# Altium schematic sheet PMW3901.SchDoc
size A4; SheetNumber: 4; SheetTotal: 7
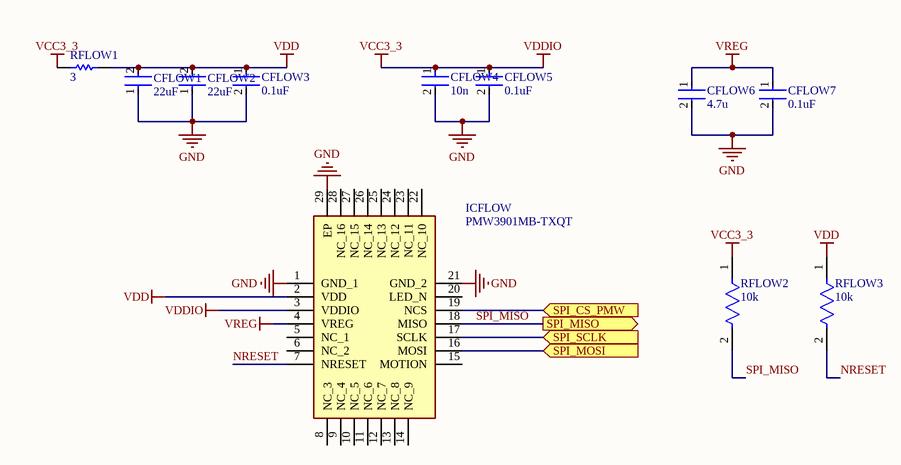
[diagram p0: PMW3901.SchDoc]

## Parts
CFLOW1  22uF  [FP-GRM188-0_2-IPC_C]
CFLOW2  22uF  [FP-GRM188-0_2-IPC_C]
CFLOW3  0.1uF  [FP-CL10-IPC_C]
CFLOW4  10n  [FP-CL10-IPC_A]
CFLOW5  0.1uF  [FP-CL10-IPC_C]
CFLOW6  4.7u  [FP-CL10-IPC_C]
CFLOW7  0.1uF  [FP-CL10-IPC_C]
ICFLOW  PMW3901MB-TXQT  [PMW3901MBTXQT]
RFLOW1  3  [RESC1608X55X30NL15T15]
RFLOW2  10k  [FP-ERJ3G-IPC_C]
RFLOW3  10k  [FP-ERJ3G-IPC_C]

## Ports
SPI_CS_PMW (in), SPI_MISO (out), SPI_MOSI (in), SPI_SCLK (in)

## Nets
GND: CFLOW1.1 CFLOW2.1 CFLOW3.2 CFLOW4.2 CFLOW5.2 CFLOW6.2 CFLOW7.2 ICFLOW.1(GND_1) ICFLOW.21(GND_2) ICFLOW.29(EP)
VCC3_3: CFLOW4.1 CFLOW5.1 ICFLOW.3(VDDIO) RFLOW1.1 RFLOW2.1  [also labelled VDDIO]
VDD: CFLOW1.2 CFLOW2.2 CFLOW3.1 ICFLOW.2(VDD) RFLOW1.2 RFLOW3.1
VREG: CFLOW6.1 CFLOW7.1 ICFLOW.4(VREG)
NRESET: ICFLOW.7(NRESET) RFLOW3.2
SPI_CS_PMW: ICFLOW.19(NCS) ; port SPI_CS_PMW
SPI_MISO: ICFLOW.18(MISO) RFLOW2.2 ; port SPI_MISO
SPI_MOSI: ICFLOW.16(MOSI) ; port SPI_MOSI
SPI_SCLK: ICFLOW.17(SCLK) ; port SPI_SCLK

Not connected (* = marked no-connect by the designer): ICFLOW 5(NC_1) 6(NC_2) 8(NC_3) 9(NC_4) 10(NC_5) 11(NC_6) 12(NC_7) 13(NC_8) 14(NC_9) 15(MOTION) 20(LED_N) 22(NC_10) 23(NC_11) 24(NC_12) 25(NC_13) 26(NC_14) 27(NC_15) 28(NC_16)

## Library data of the parts
CFLOW1 CFLOW2 = CMP-2000-06337-3: Chip Multilayer Ceramic Capacitors for General Purpose, 0603, 22uF, X5R, 15%, 20%, 10V; Tolerance: 20%; Weight: 0.000222oz; Material: Ceramic; Depth: 0.8mm; Length: 1.6mm; Termination: SMD/SMT; Capacitance: 22uF; Packaging: Tape and Reel; Width: 0.8mm; Voltage Rating: 10V; Case Code (Imperial): 0603; Mount: Surface Mount; Voltage Rating (DC): 10V; Case/Package: 0603; Thickness: 0.039inch; REACH SVHC: No SVHC; Dielectric: X5R; Height: 0.8mm; Package Quantity: 4000; Case Code (Metric): 1608; Min Operating Temperature: -55°C; Lead Free: Lead Free; Max Operating Temperature: 85°C
CFLOW3 CFLOW5 CFLOW7 = CMP-13271-001724-1: Cap Ceramic 100nF 50V X7R ±20% Pad SMD 0603 +125°C T/R; Mount: Surface Mount; Lead Free: Lead Free; Max Operating Temperature: 125°C; Voltage Rating: 50V; Case Code (Imperial): 0603; Capacitance: 100nF; Height: 0.8mm; Length: 1.6mm; Tolerance: 20%; Case Code (Metric): 1608; Thickness: 0.035inch; Depth: 0.8mm; Width: 0.031inch; Package Quantity: 1; Min Operating Temperature: -55°C; Case/Package: 0603; Radiation Hardening: No; Voltage Rating (DC): 50V; Dielectric: X7R; Packaging: Tape and Reel
CFLOW4 = CMP-13271-001215-1: Cap Ceramic 10nF 50V X7R ±10% Pad SMD 0603 +125°C T/R; Dielectric: X7R; Features: Soft Termination; Packaging: Tape and Reel; Voltage Rating: 50V; Ratings: AEC-Q200; Radiation Hardening: No; Height: 0.8mm; Package Quantity: 4000; Case Code (Metric): 1608; Capacitance: 10nF; Length: 1.6mm; Width: 0.031inch; Case/Package: 0603; Thickness: 0.035inch; Tolerance: 10%; Max Operating Temperature: 125°C; Lead Free: Lead Free; Mount: Surface Mount; Min Operating Temperature: -55°C; Case Code (Imperial): 0603; Voltage: 50V; Depth: 0.8mm
CFLOW6 = CMP-13271-003017-1: Cap Ceramic 4.7uF 10V X5R ±10% Pad SMD 0603 +85°C T/R; Capacitance: 4.7uF; Case/Package: 0603; Packaging: Tape and Reel; Width: 0.031inch; Contact Plating: Tin; Thickness: 0.035inch; Package Quantity: 1; Voltage Rating: 10V; Case Code (Metric): 1608; Case Code (Imperial): 0603; Depth: 0.8mm; Height: 0.8mm; Tolerance: 10%; Max Operating Temperature: 85°C; Length: 1.6mm; Dielectric: X5R; Mount: Surface Mount; Radiation Hardening: No; Min Operating Temperature: -55°C
ICFLOW = PMW3901MB-TXQT: Integrated Circuit; Manufacturer_Name: PixArt Imaging Inc.; Height: 2.36mm; Manufacturer_Part_Number: PMW3901MB-TXQT
RFLOW1 = CMP-2000-00787-1: Manufacturer: Panasonic; Part Number: ERJ-3GEYJ3R0V
RFLOW2 RFLOW3 = CMP-2000-00704-2: RES SMD 10K OHM 5% 1/10W 0603; Temperature Coefficient: 200ppm/°C; Max Power Dissipation: 100mW; Resistance: 10kR; Voltage Rating (DC): 50V; Voltage Rating: 75V; Resistor Type: Thick Film; Tolerance: 5%; Military Standard: Not; Package Quantity: 1; Max Operating Temperature: 155°C; Mount: Surface Mount; Technology: THICK FILM; Case/Package: 0603; Construction: Rectangular; Depth: 0.8mm; Case Code (Imperial): 0603; Weight: 7.1E-05oz; Features: Automotive AEC-Q200; Packaging: Tape and Reel; Width: 0.8mm; Length: 1.6mm; Termination: SMD/SMT; Power Rating: 100mW; Lead Free: Lead Free; Number of Terminations: 2; Height: 0.45mm; RoHS Compliant: Yes; Min Operating Temperature: -55°C; Contact Plating: Tin; REACH SVHC: No SVHC; Resistance Tolerance: 5%; Series: ERJ; Working Voltage: 75V; Case Code (Metric): 1608